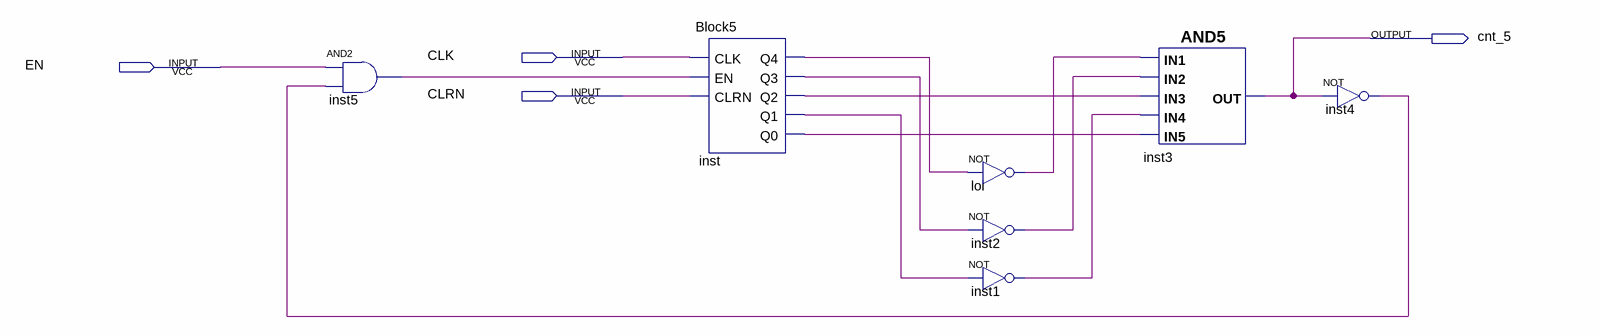
[diagram p0: schematic sheet]
// Quartus schematic Block6.bdf as structural Verilog: 7 symbols, 4 pins
module Block6 (
  input  CLK,
  input  EN,
  input  CLRN,
  output cnt_5
);

  wire inst1_out, inst2_out, inst4_out, inst5_out, inst_q0, inst_q1, inst_q2, inst_q3, inst_q4, lol_out;

  and inst5 (inst5_out, EN, inst4_out);
  Block5 inst (
    .CLK(CLK), .EN(inst5_out), .CLRN(CLRN), .Q4(inst_q4), .Q3(inst_q3), .Q2(inst_q2), .Q1(inst_q1),
    .Q0(inst_q0));
  not lol (lol_out, inst_q4);
  not inst2 (inst2_out, inst_q3);
  not inst1 (inst1_out, inst_q1);
  and inst3 (cnt_5, lol_out, inst2_out, inst_q2, inst1_out, inst_q0);
  not inst4 (inst4_out, cnt_5);
endmodule
